# Altium schematic sheet lemo.SchDoc
size A; SheetNumber: 17; SheetTotal: 17
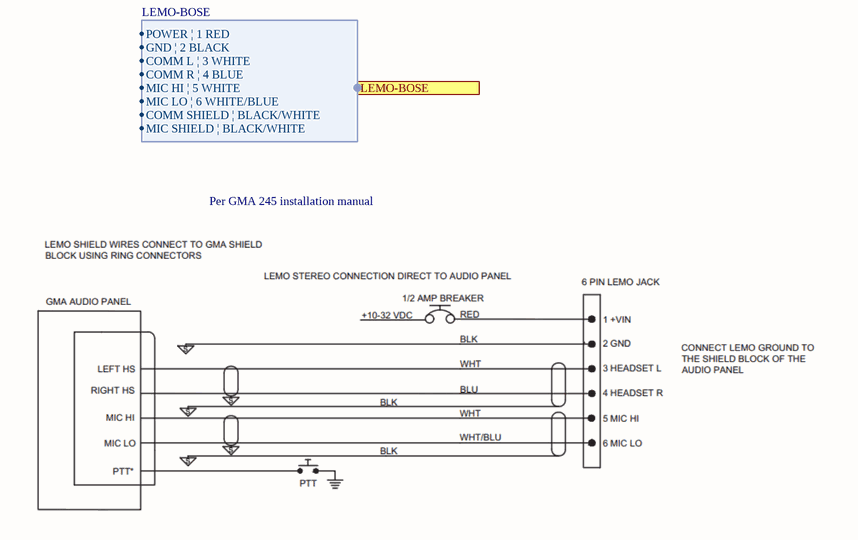
[diagram p0: lemo.SchDoc]

## Ports
LEMO-BOSE (harness LEMO-BOSE)

## Harnesses
LEMO-BOSE: POWER | 1 RED, GND | 2 BLACK, COMM L | 3 WHITE, COMM R | 4 BLUE, MIC HI | 5 WHITE, MIC LO | 6 WHITE/BLUE, COMM SHIELD | BLACK/WHITE, MIC SHIELD | BLACK/WHITE

## Notes on the sheet
- Per GMA 245 installation manual